# Altium schematic sheet CAN_schematic.SchDoc: CAN transceiver and test switches
size A4; Organization: UFSC; DocumentNumber: 5; SheetNumber: 5; SheetTotal: 8
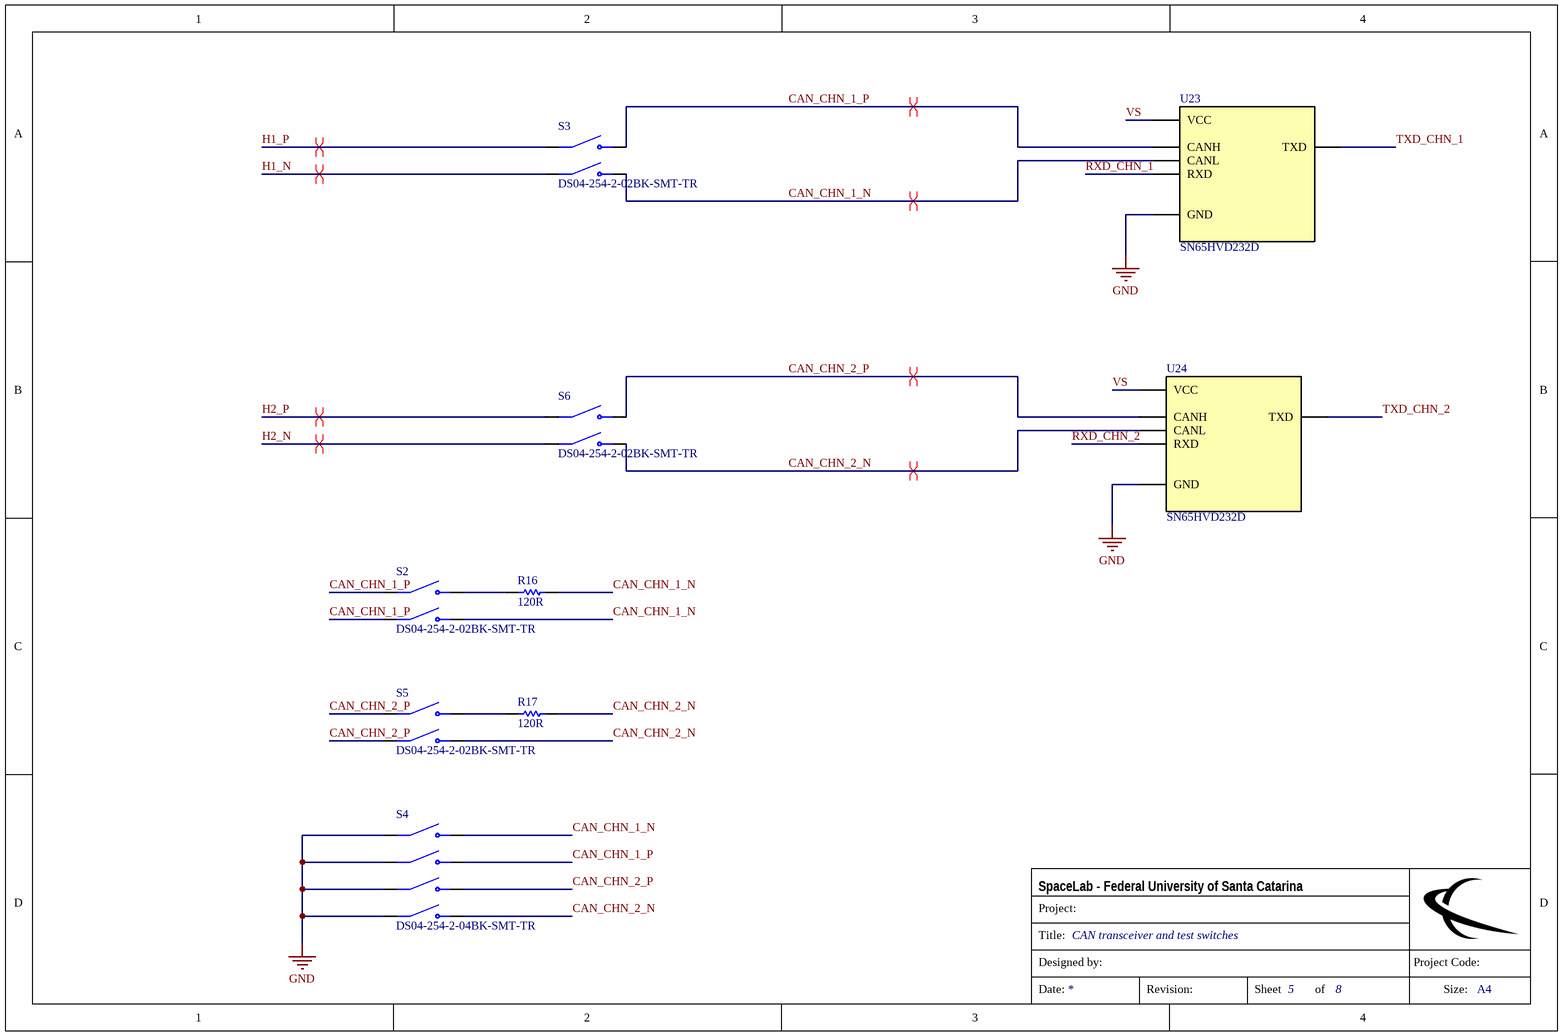
[diagram p0: CAN_schematic.SchDoc]

## Parts
R16  120R  [0805]
R17  120R  [0805]
S2  DS04-254-2-02BK-SMT-TR  [SW_DS04-254-2-02BK-SMT-TR]
S3  DS04-254-2-02BK-SMT-TR  [SW_DS04-254-2-02BK-SMT-TR]
S4  DS04-254-2-04BK-SMT-TR  [SW_DS04-254-2-04BK-SMT-TR]
S5  DS04-254-2-02BK-SMT-TR  [SW_DS04-254-2-02BK-SMT-TR]
S6  DS04-254-2-02BK-SMT-TR  [SW_DS04-254-2-02BK-SMT-TR]
U23  SN65HVD232D  [SOIC127P599X175-8N]
U24  SN65HVD232D  [SOIC127P599X175-8N]

## Nets
GND: S4.1A(COM1) S4.2A(COM2) S4.3A(COM3) S4.4A(COM4) U23.2(GND) U24.2(GND)
CAN_CHN_1_N: R16.1 S2.2B(NO2) S3.2B(NO2) S4.1B(NO1) U23.6(CANL)
CAN_CHN_1_P: S2.1A(COM1) S2.2A(COM2) S3.1B(NO1) S4.2B(NO2) U23.7(CANH)
CAN_CHN_2_N: R17.1 S4.4B(NO4) S5.2B(NO2) S6.2B(NO2) U24.6(CANL)
CAN_CHN_2_P: S4.3B(NO3) S5.1A(COM1) S5.2A(COM2) S6.1B(NO1) U24.7(CANH)
H1_N: S3.2A(COM2)
H1_P: S3.1A(COM1)
H2_N: S6.2A(COM2)
H2_P: S6.1A(COM1)
RXD_CHN_1: U23.4(RXD)
RXD_CHN_2: U24.4(RXD)
TXD_CHN_1: U23.1(TXD)
TXD_CHN_2: U24.1(TXD)
VS: U23.3(VCC) U24.3(VCC)
NetR16_2: R16.2 S2.1B(NO1)
NetR17_2: R17.2 S5.1B(NO1)

## Layout directives
differential pair: CAN_CHN_1_N, CAN_CHN_1_P, CAN_CHN_2_N, CAN_CHN_2_P, H1_N, H1_P, H2_N, H2_P

## Notes on the sheet
- Project:
- SpaceLab - Federal University of Santa Catarina
- Title:
- Designed by:
- Project Code:
- Date:
- Revision:
- Sheet
- of
- Size:
- A4

## Library data of the parts
R16 R17 = R120R_1%_1/4W_0805: RES 120R OHM 1/8W 1% 0805; Manufacturer Part Number: CRGCQ0805F120R; NCM: 8533.21.20
S2 S3 S5 S6 = DS04-254-2-02BK-SMT-TR: 1 ~ 12 positions, Surface Mount, 2.54 mm Pitch, Slide Actuator, DIP Switch; MF: CUI Devices; Value: *; Availability: Unavailable; Price: None; SnapEDA_Link: https://www.snapeda.com/parts/DS04-254-2-02BK-SMT-TR/CUI%20Devices/view-part/4467272/?ref=snap; Package: None; Manufacturer Part Number: DS04-254-2-02BK-SMT-TR
S4 = DS04-254-2-04BK-SMT-TR: 1 ~ 12 positions, Surface Mount, 2.54 mm Pitch, Slide Actuator, DIP Switch; MF: CUI Devices; Package: None; Availability: Unavailable; Value: *; CUI_purchase_URL: https://www.cuidevices.com/product/switches/dip-switches/ds04-254-smt-series?utm_source=snapeda.com&utm_medium=referral&utm_campaign=snapedaBOM; Price: None; SnapEDA_Link: https://www.snapeda.com/parts/DS04-254-2-04BK-SMT-TR/CUI%20Devices/view-part/4467310/?ref=snap; Mouser-Purchase-URL: https://snapeda.com/shop?store=Mouser&id=4467310; Manufacturer Part Number: DS04-254-2-04BK-SMT-TR
U23 U24 = SN65HVD232D: 3.3 V CAN Transceiver; MF: Texas Instruments; Availability: Unavailable; Package: SOIC-8 Texas Instruments; DigiKey-Purchase-URL: https://snapeda.com/shop?store=DigiKey&id=230614; SnapEDA_Link: https://www.snapeda.com/parts/SN65HVD232D/Texas%20Instruments/view-part/230614/?ref=snap; Mouser-Purchase-URL: https://snapeda.com/shop?store=Mouser&id=230614; Value: *; Price: None; Texas_Instruments-Purchase-URL: https://snapeda.com/shop?store=Texas+Instruments&id=230614; Manufacturer Part Number: SN65HVD232D